# EAGLE schematic Carrier_Board (EAGLE 9.5.2)
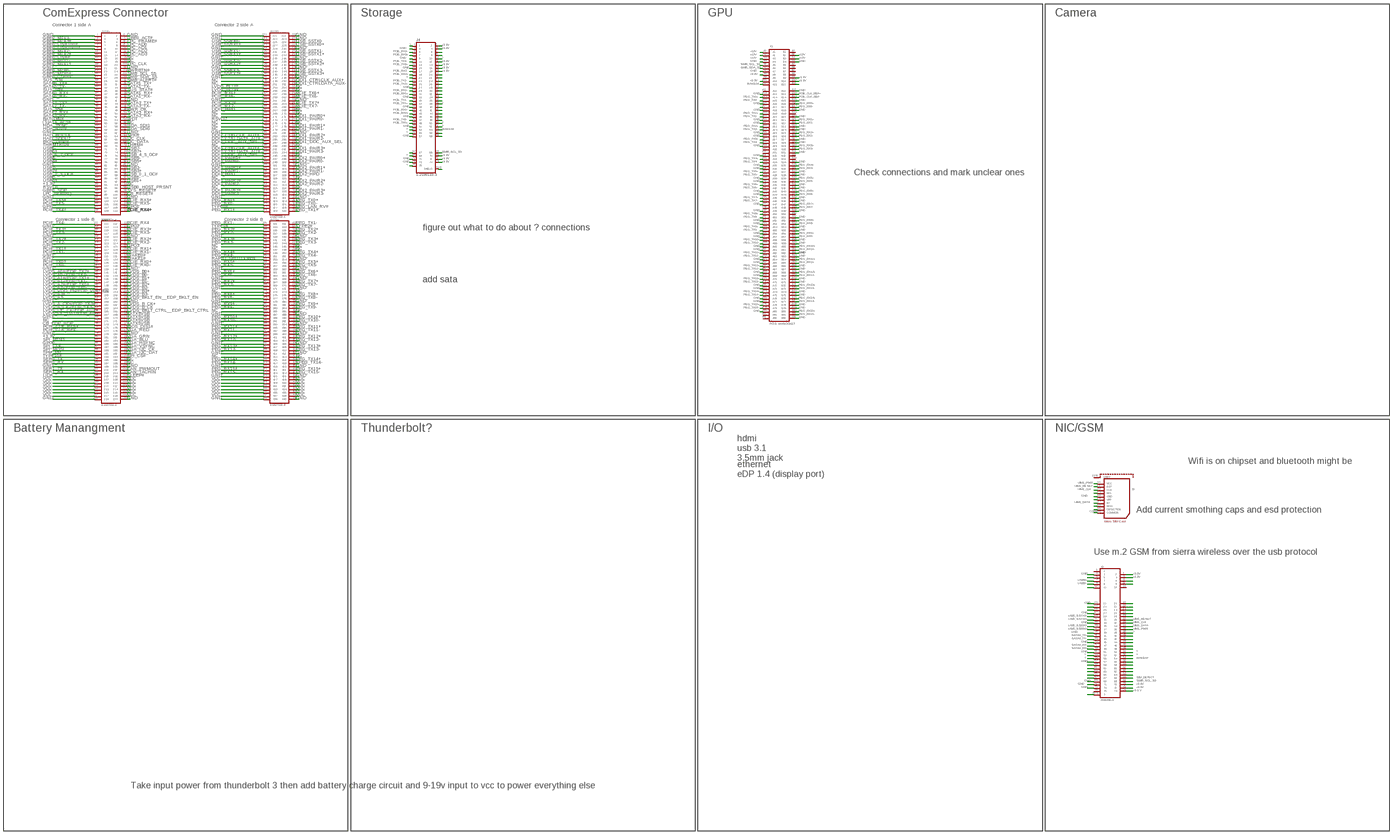
[diagram p0: schematic, sheet 1, overview]
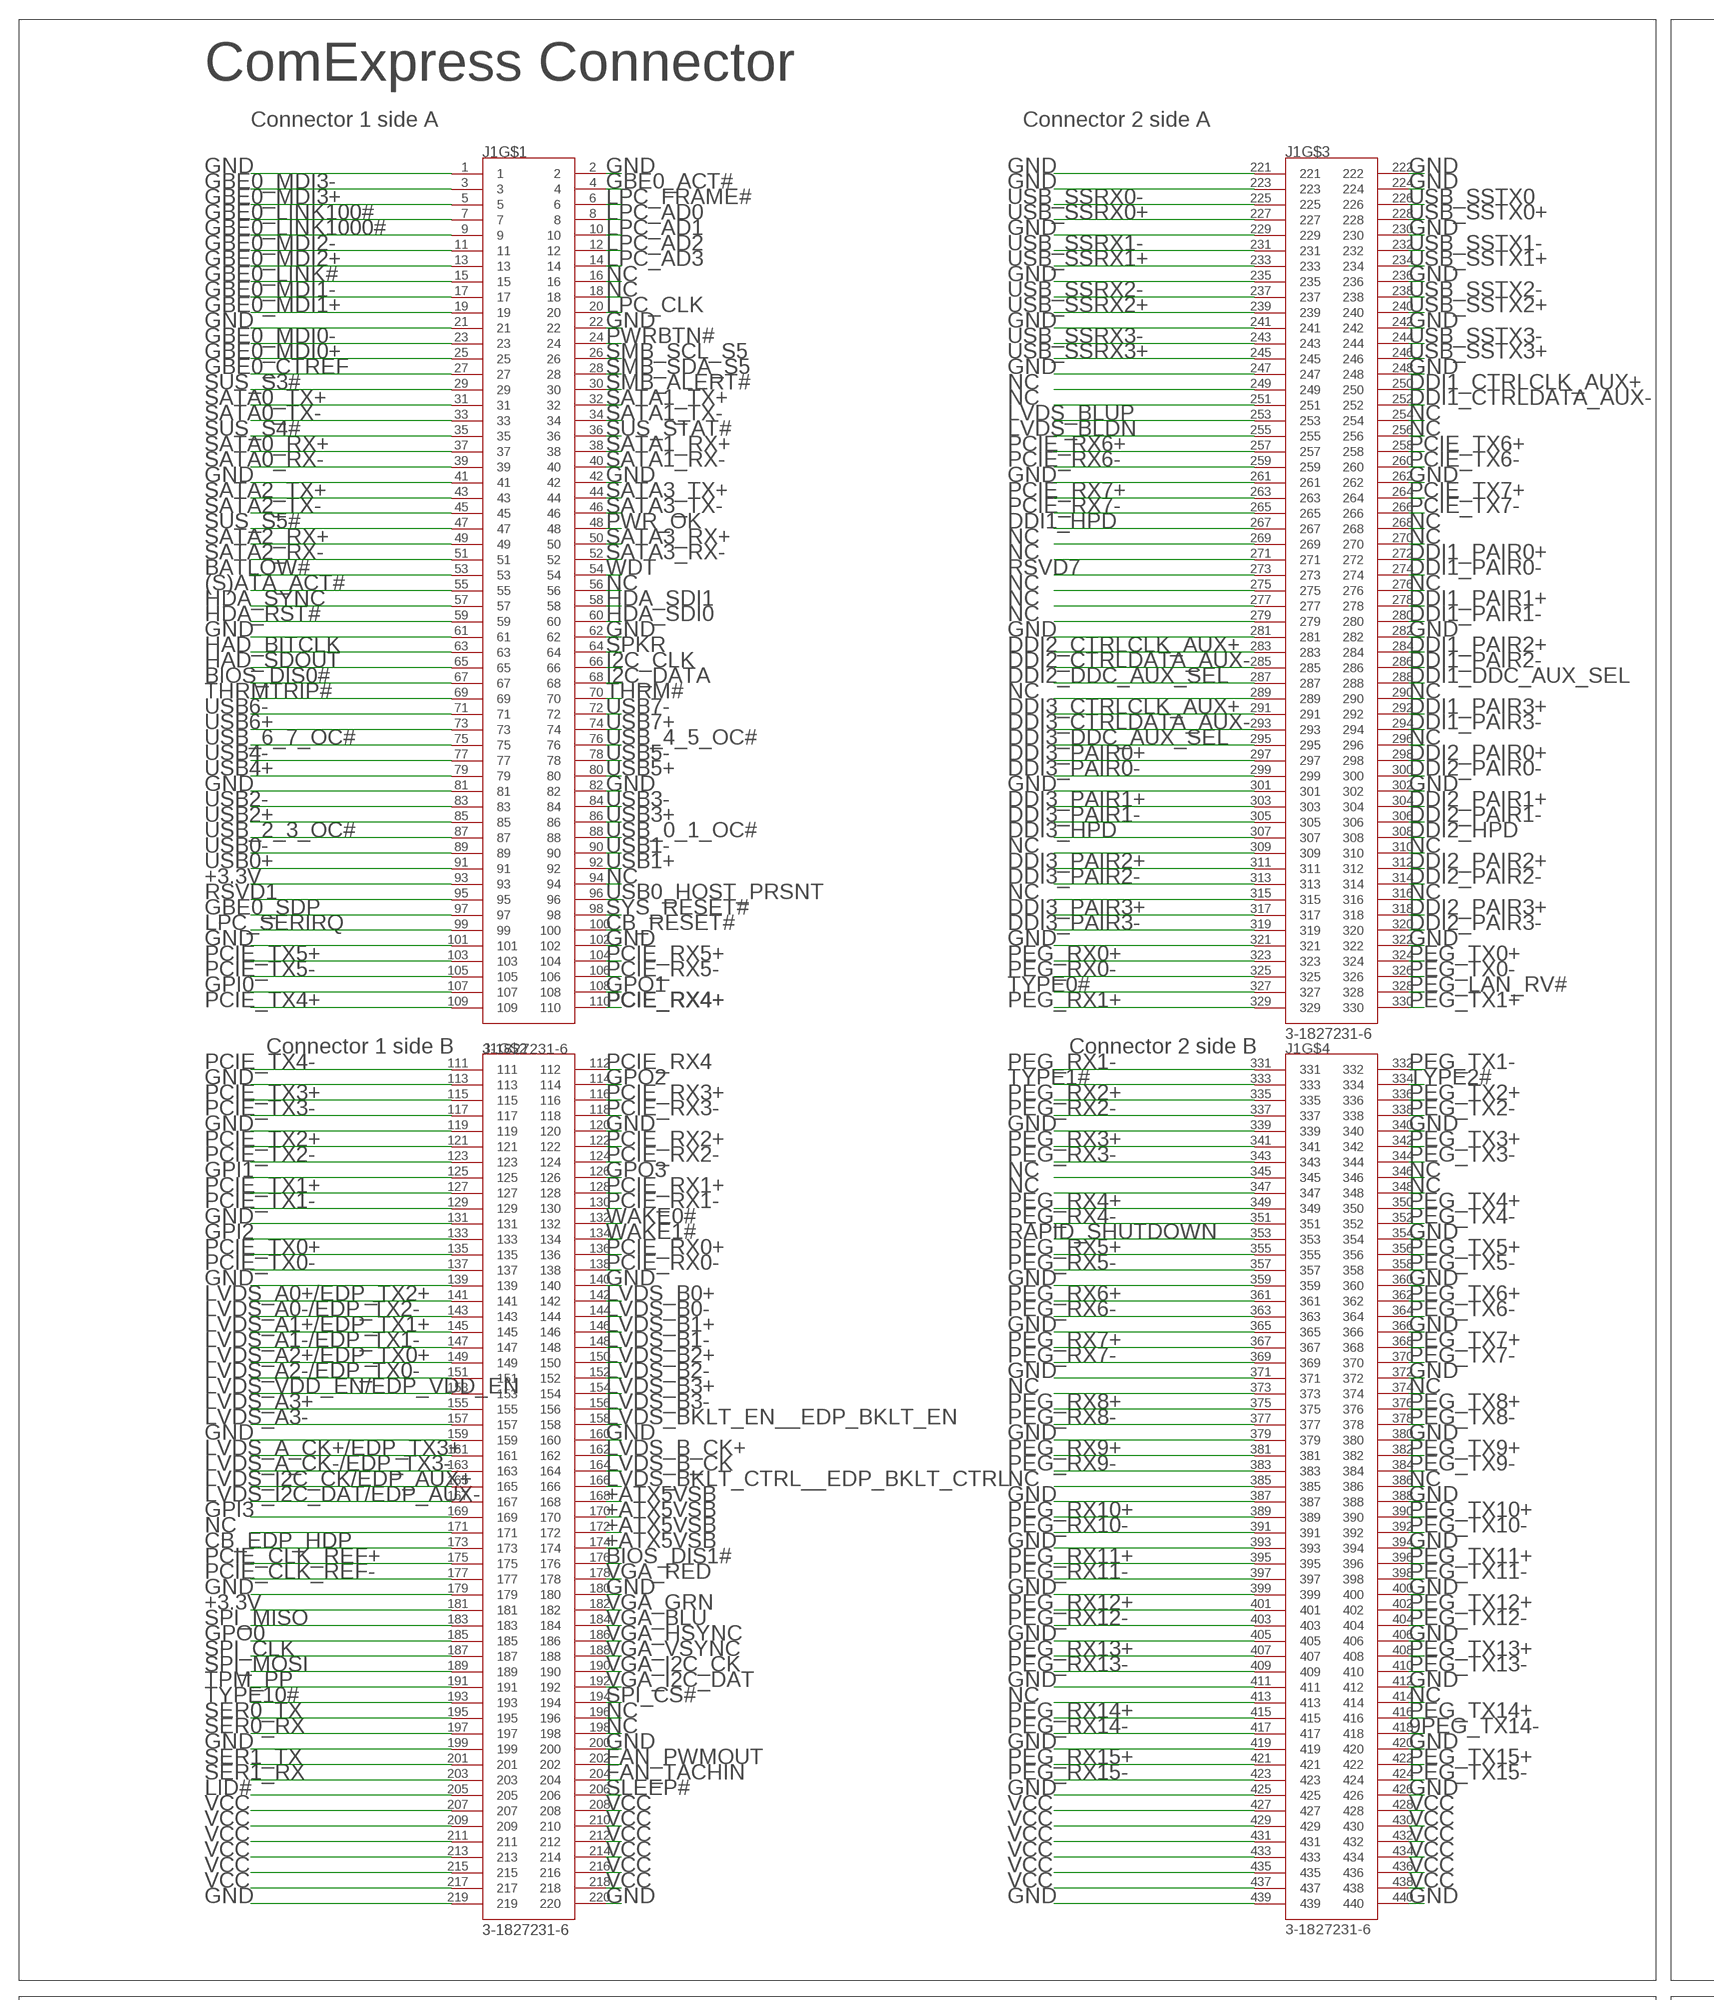
[diagram p1: schematic, sheet 1, part 1 of 8]
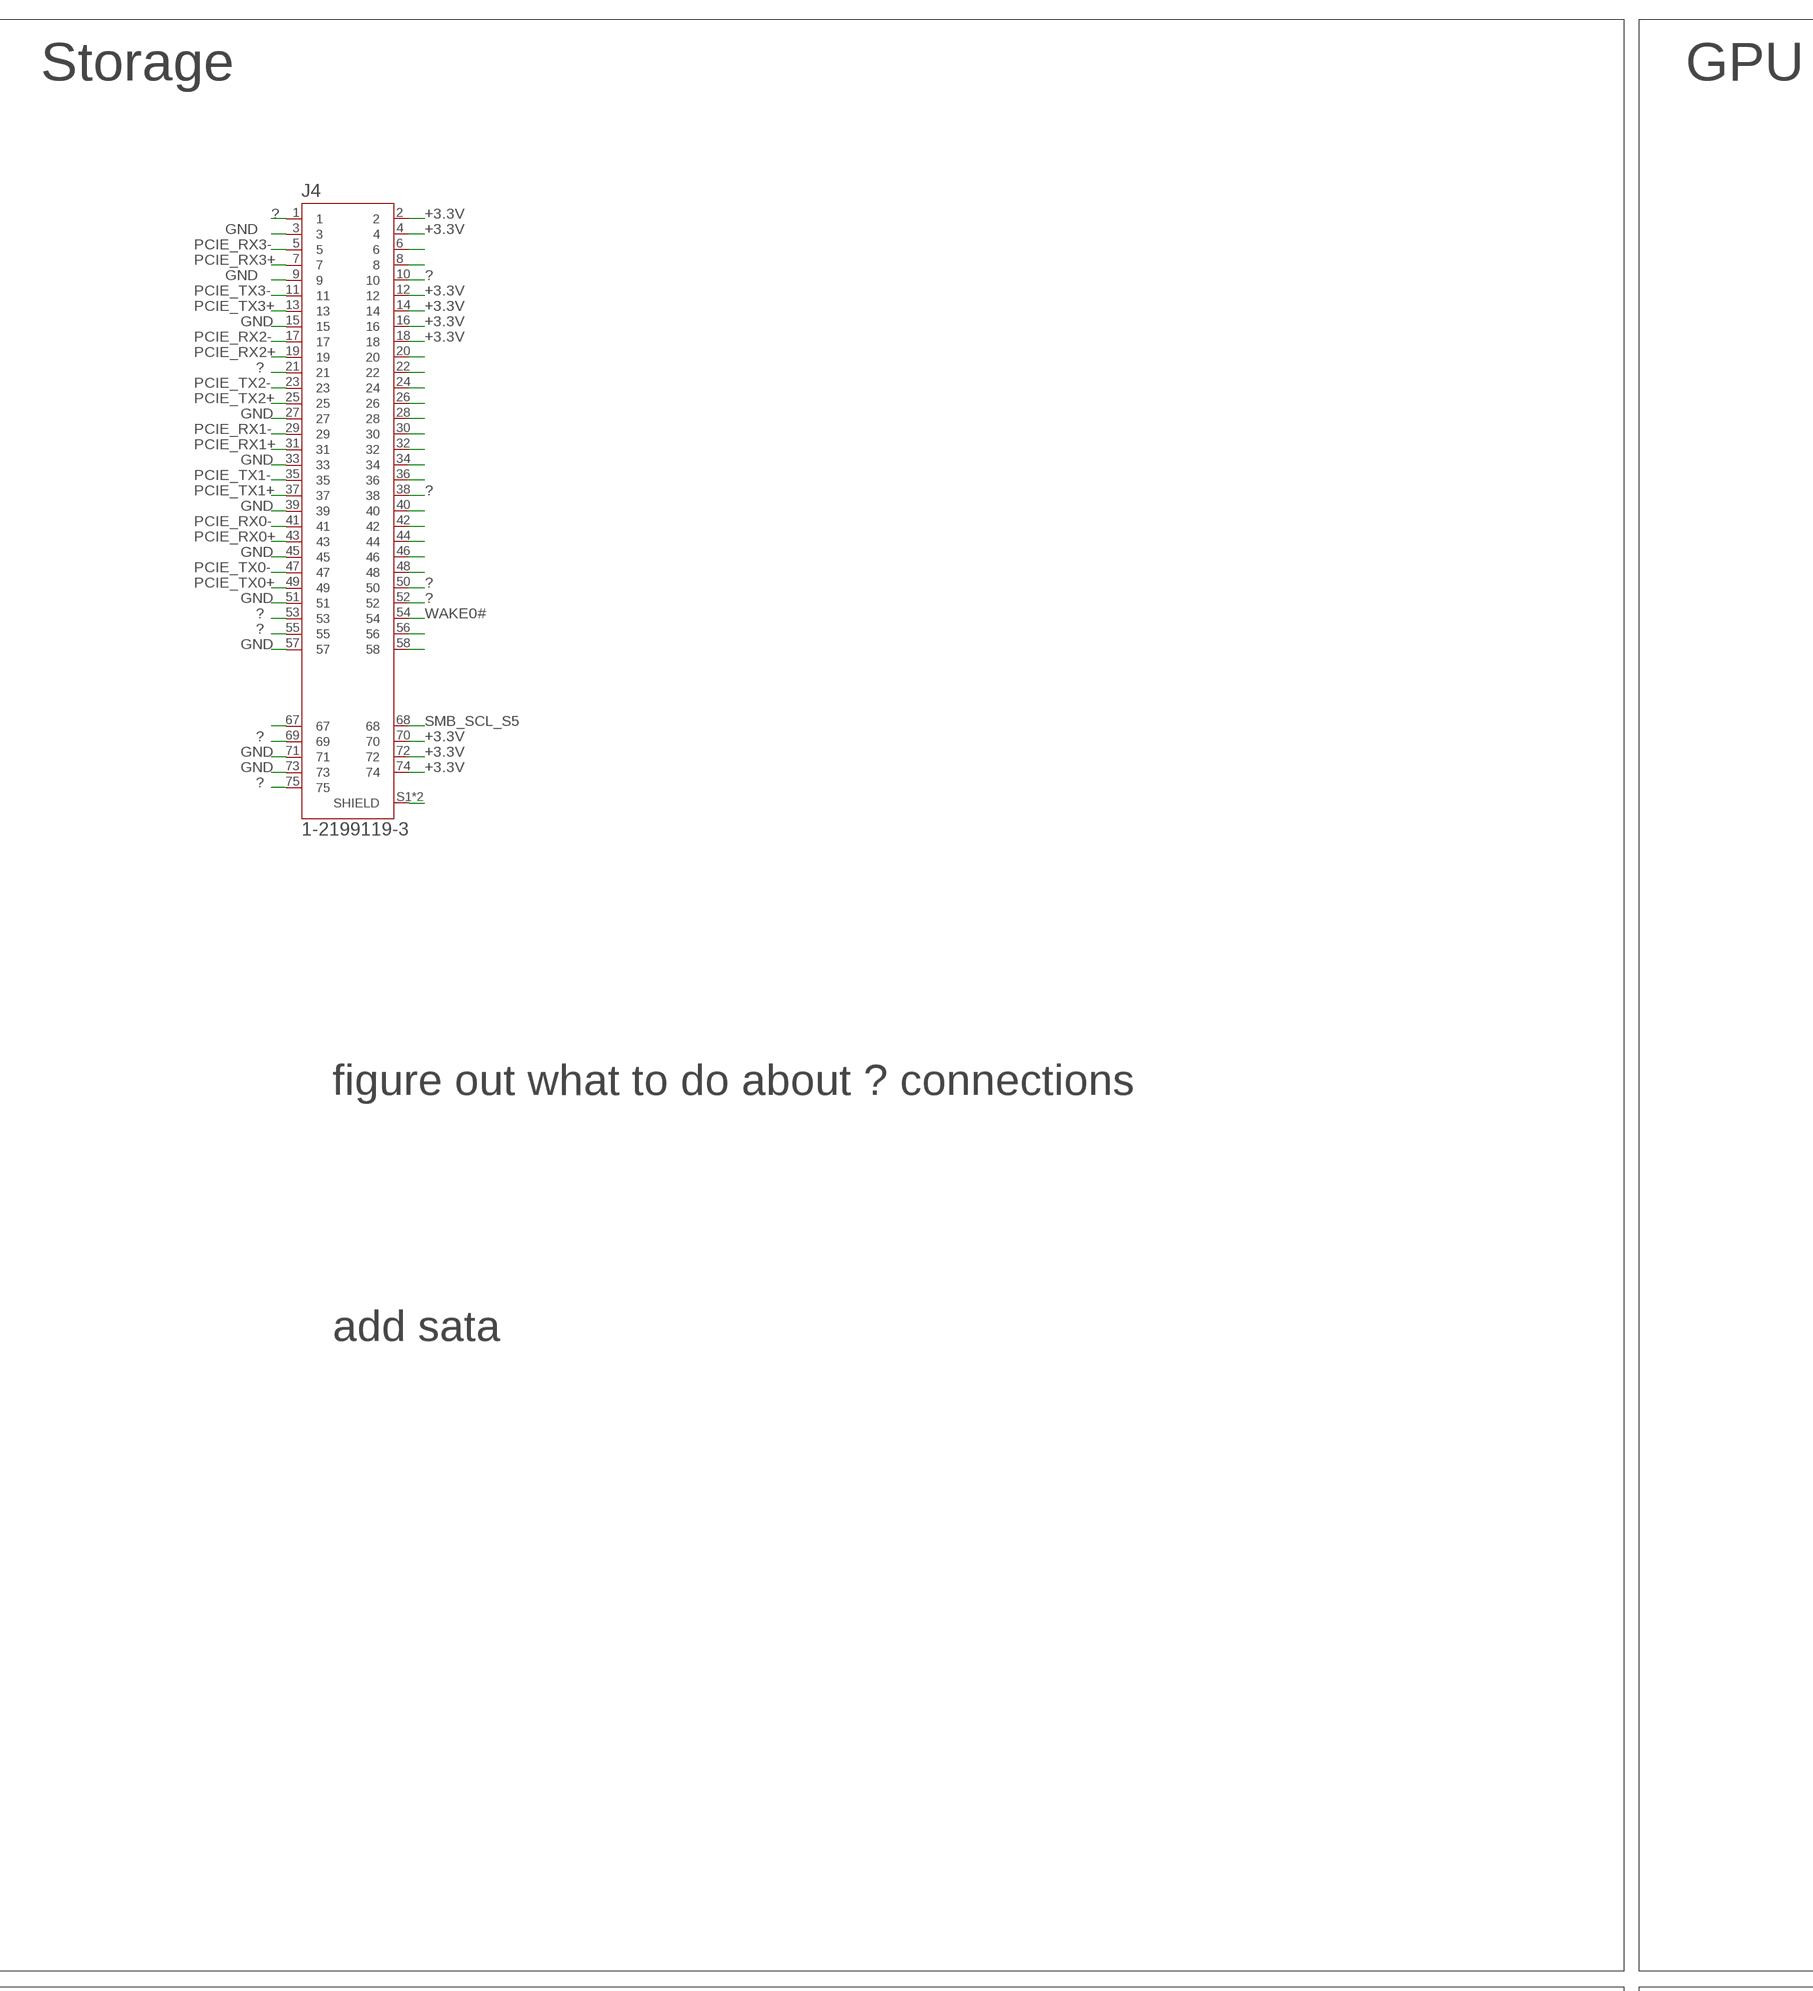
[diagram p2: schematic, sheet 1, part 2 of 8]
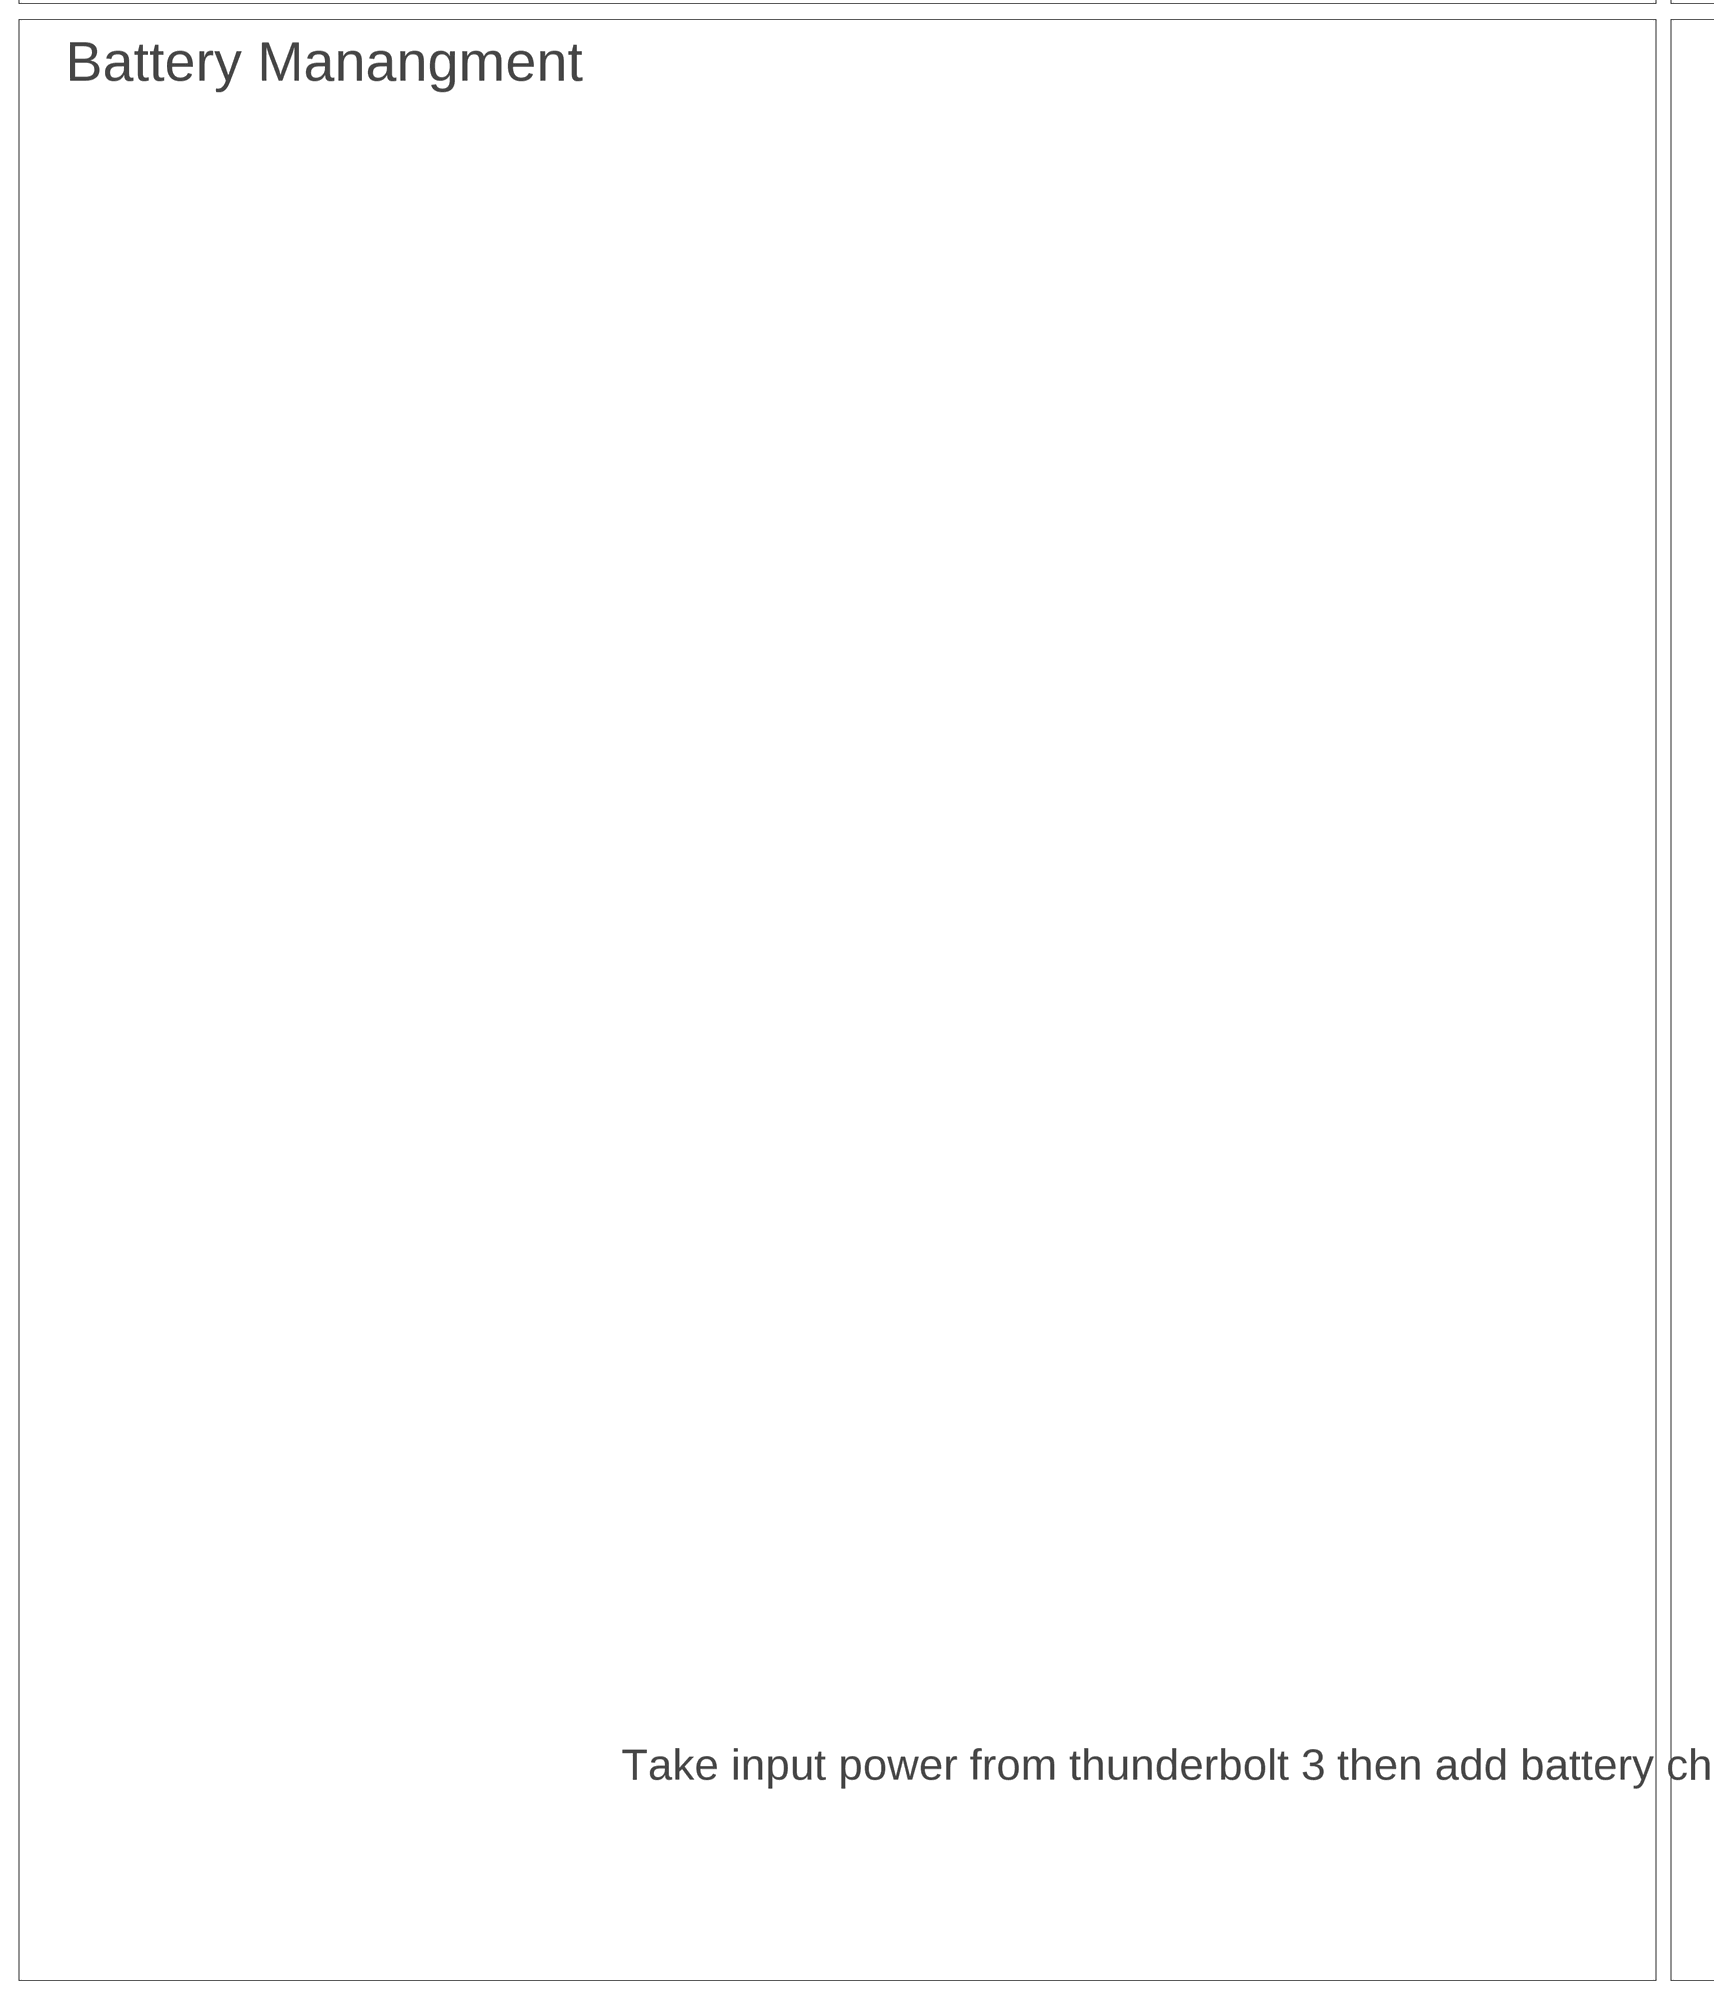
[diagram p3: schematic, sheet 1, part 3 of 8]
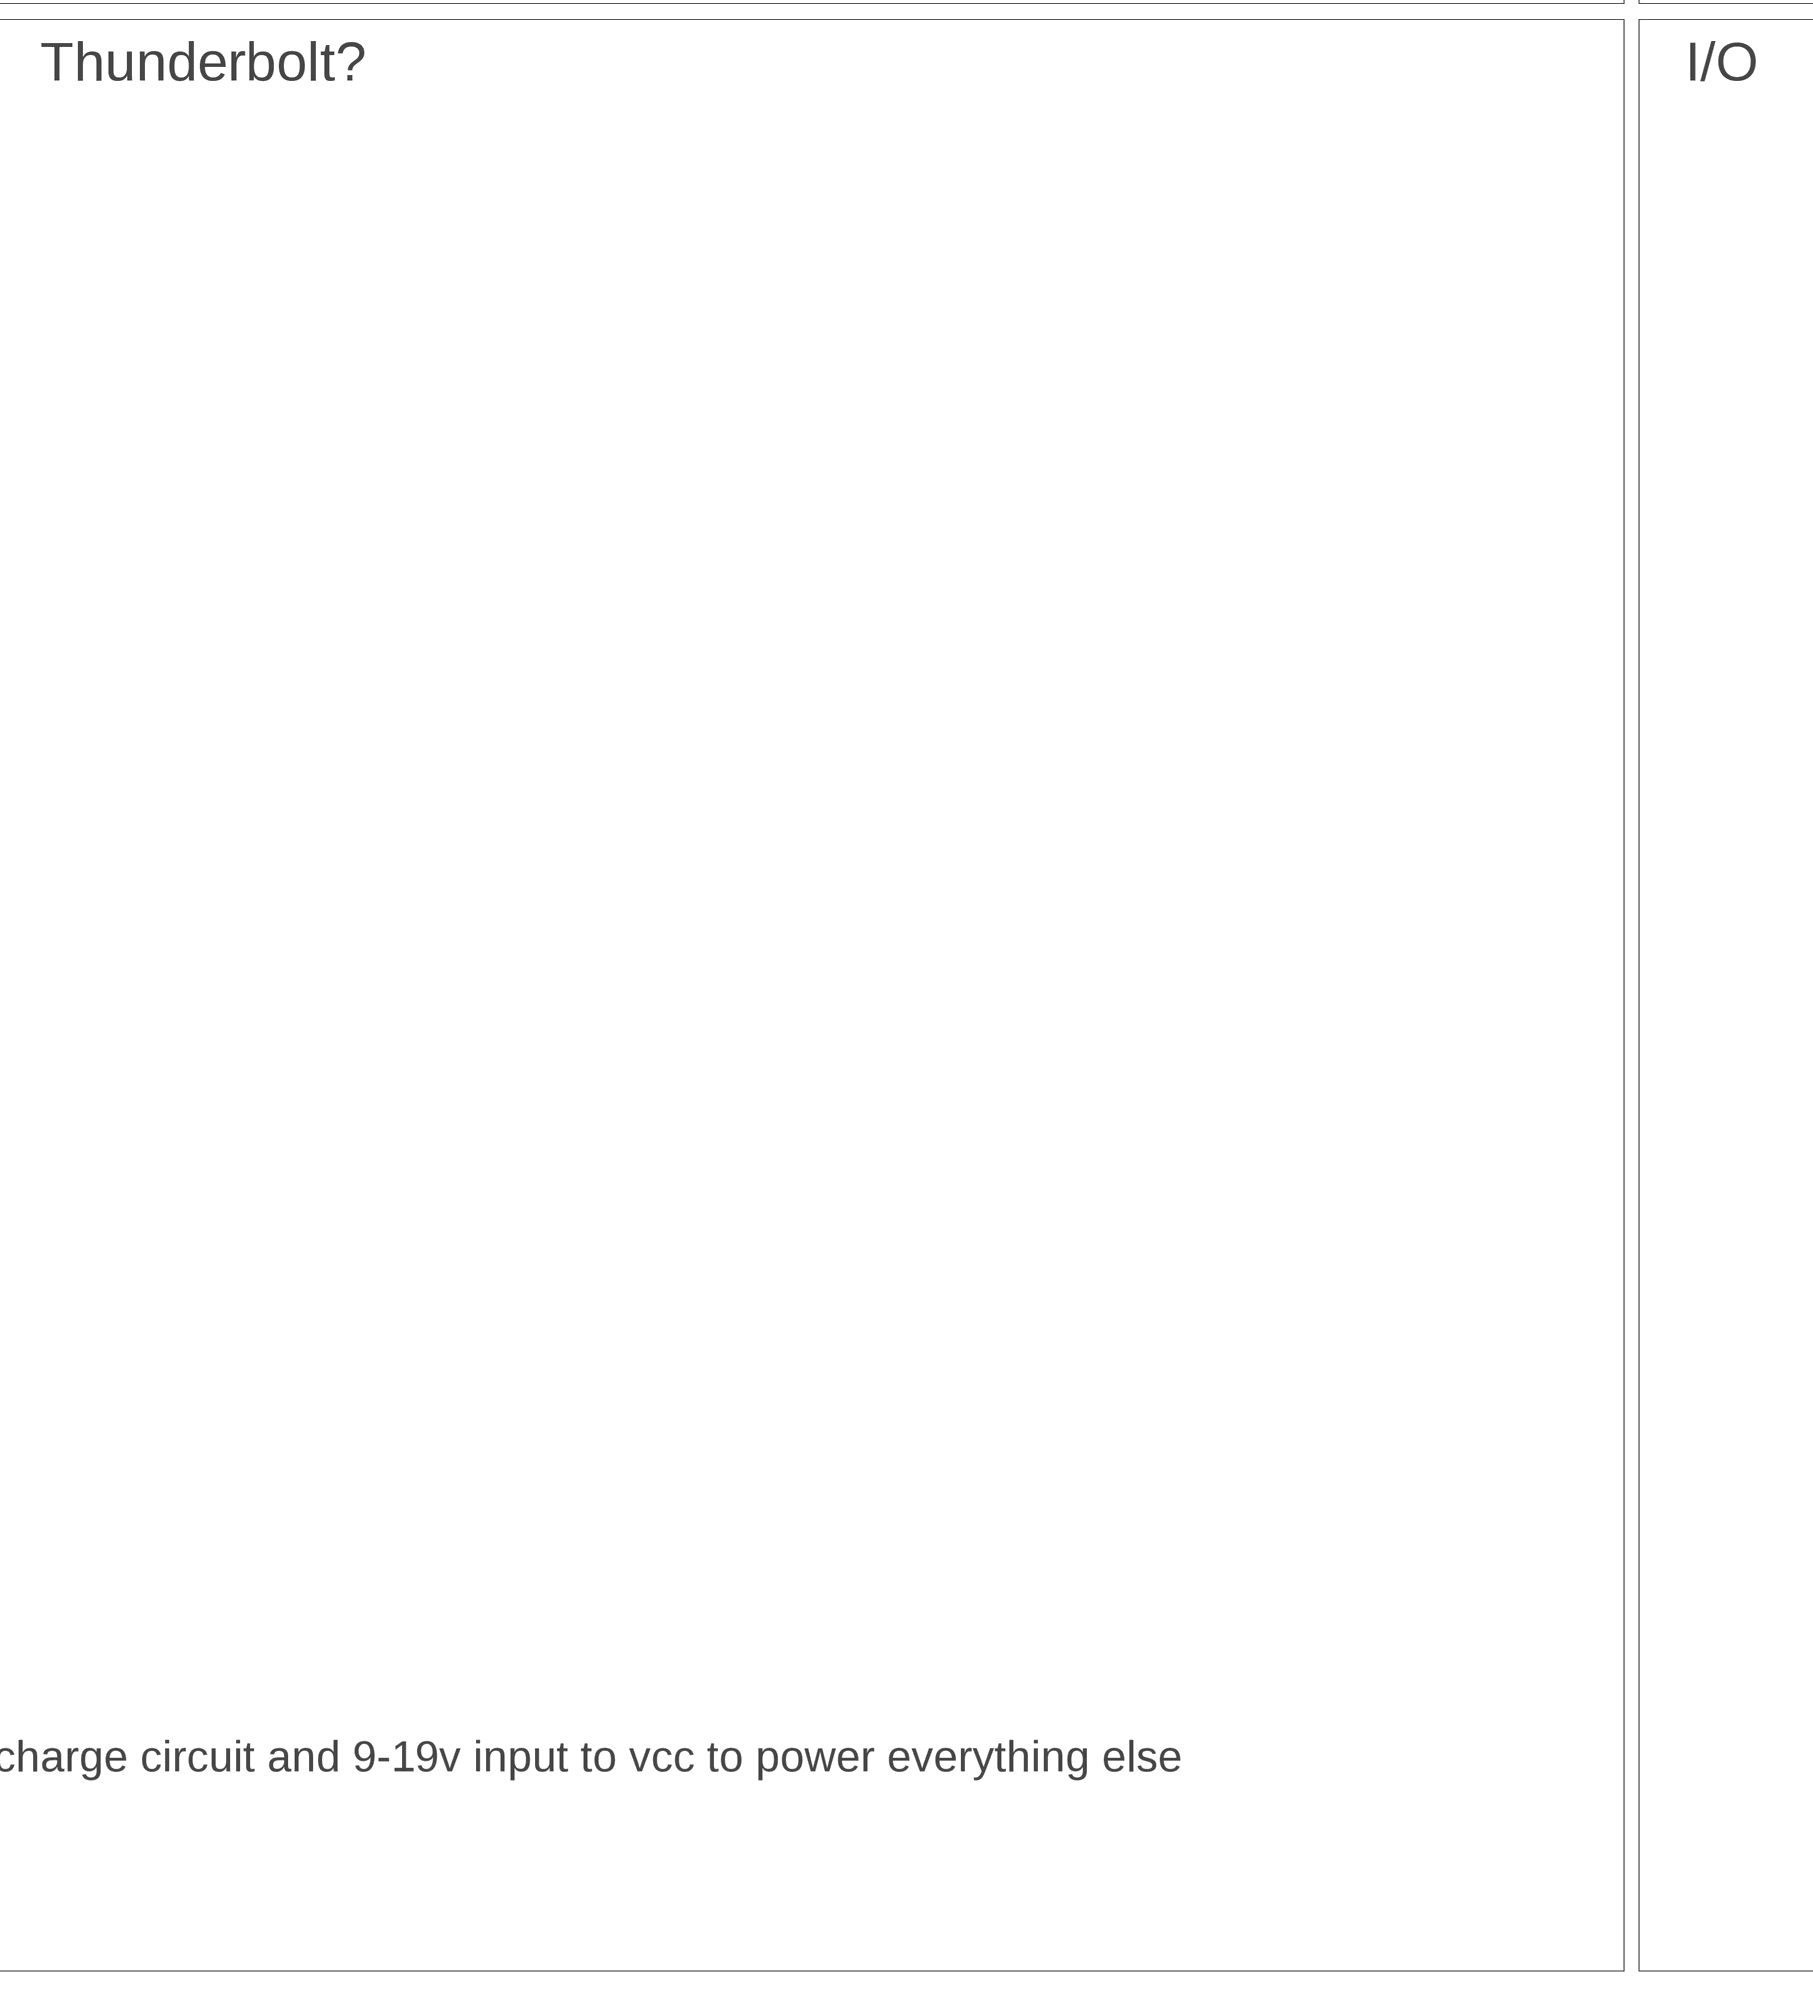
[diagram p4: schematic, sheet 1, part 4 of 8]
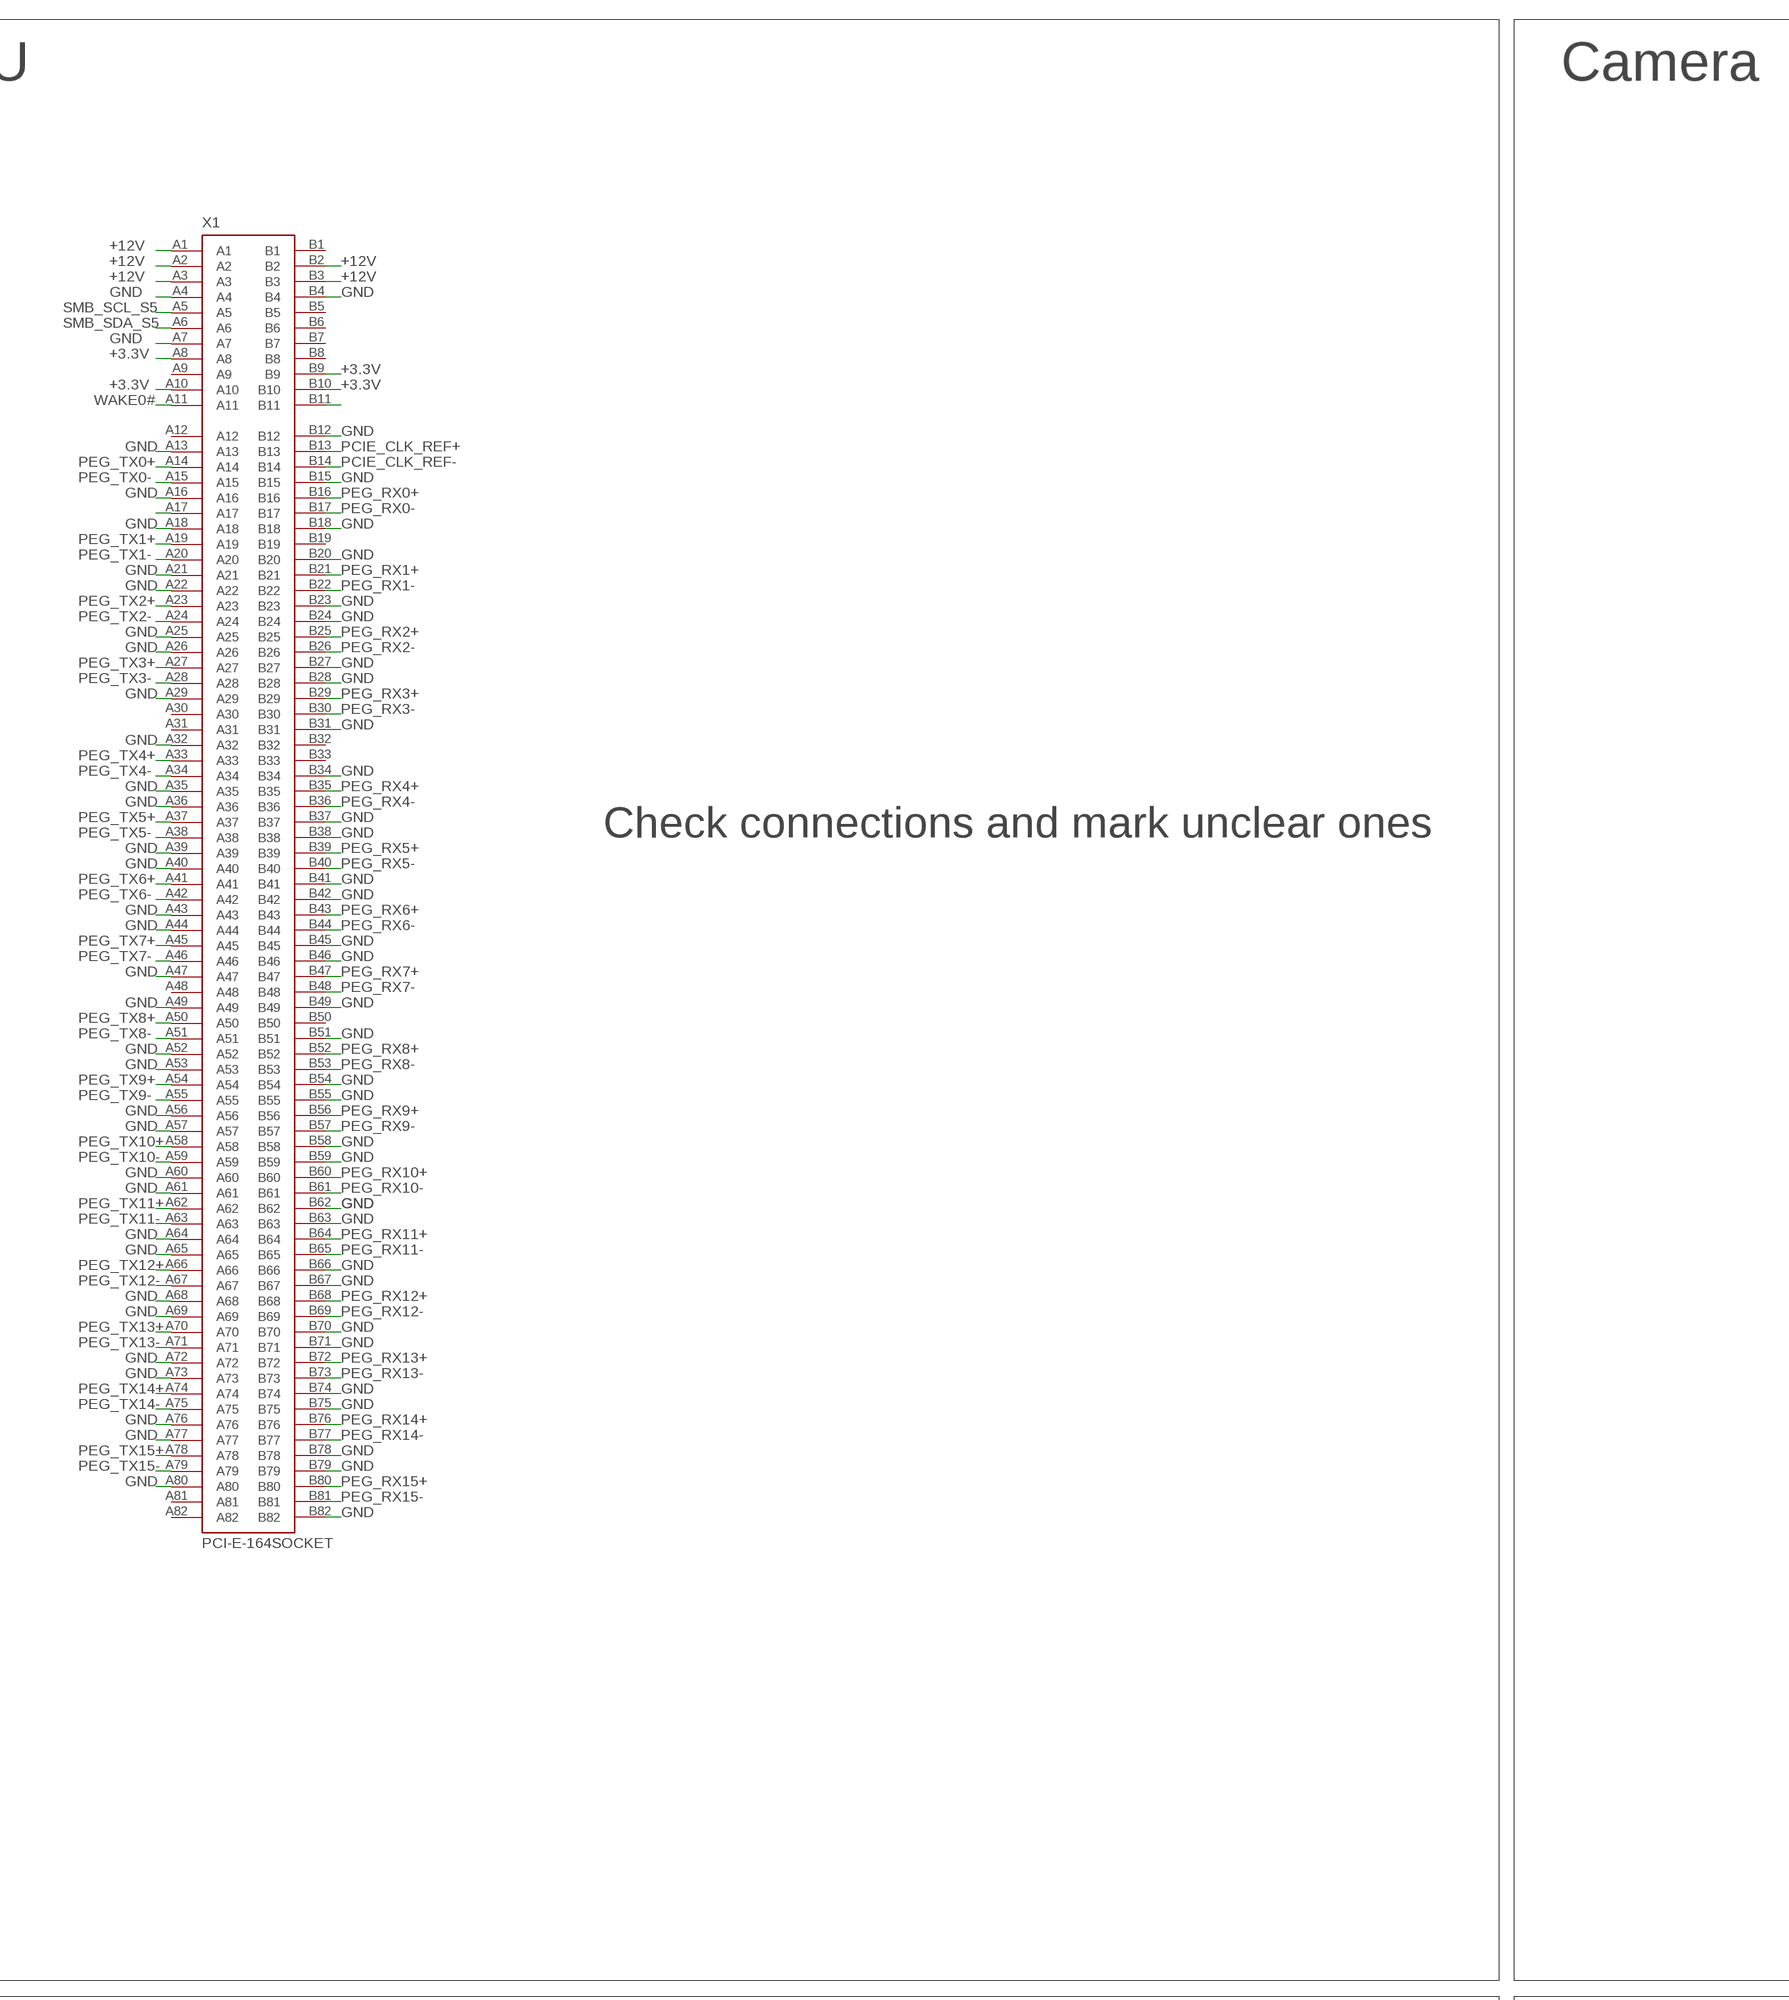
[diagram p5: schematic, sheet 1, part 5 of 8]
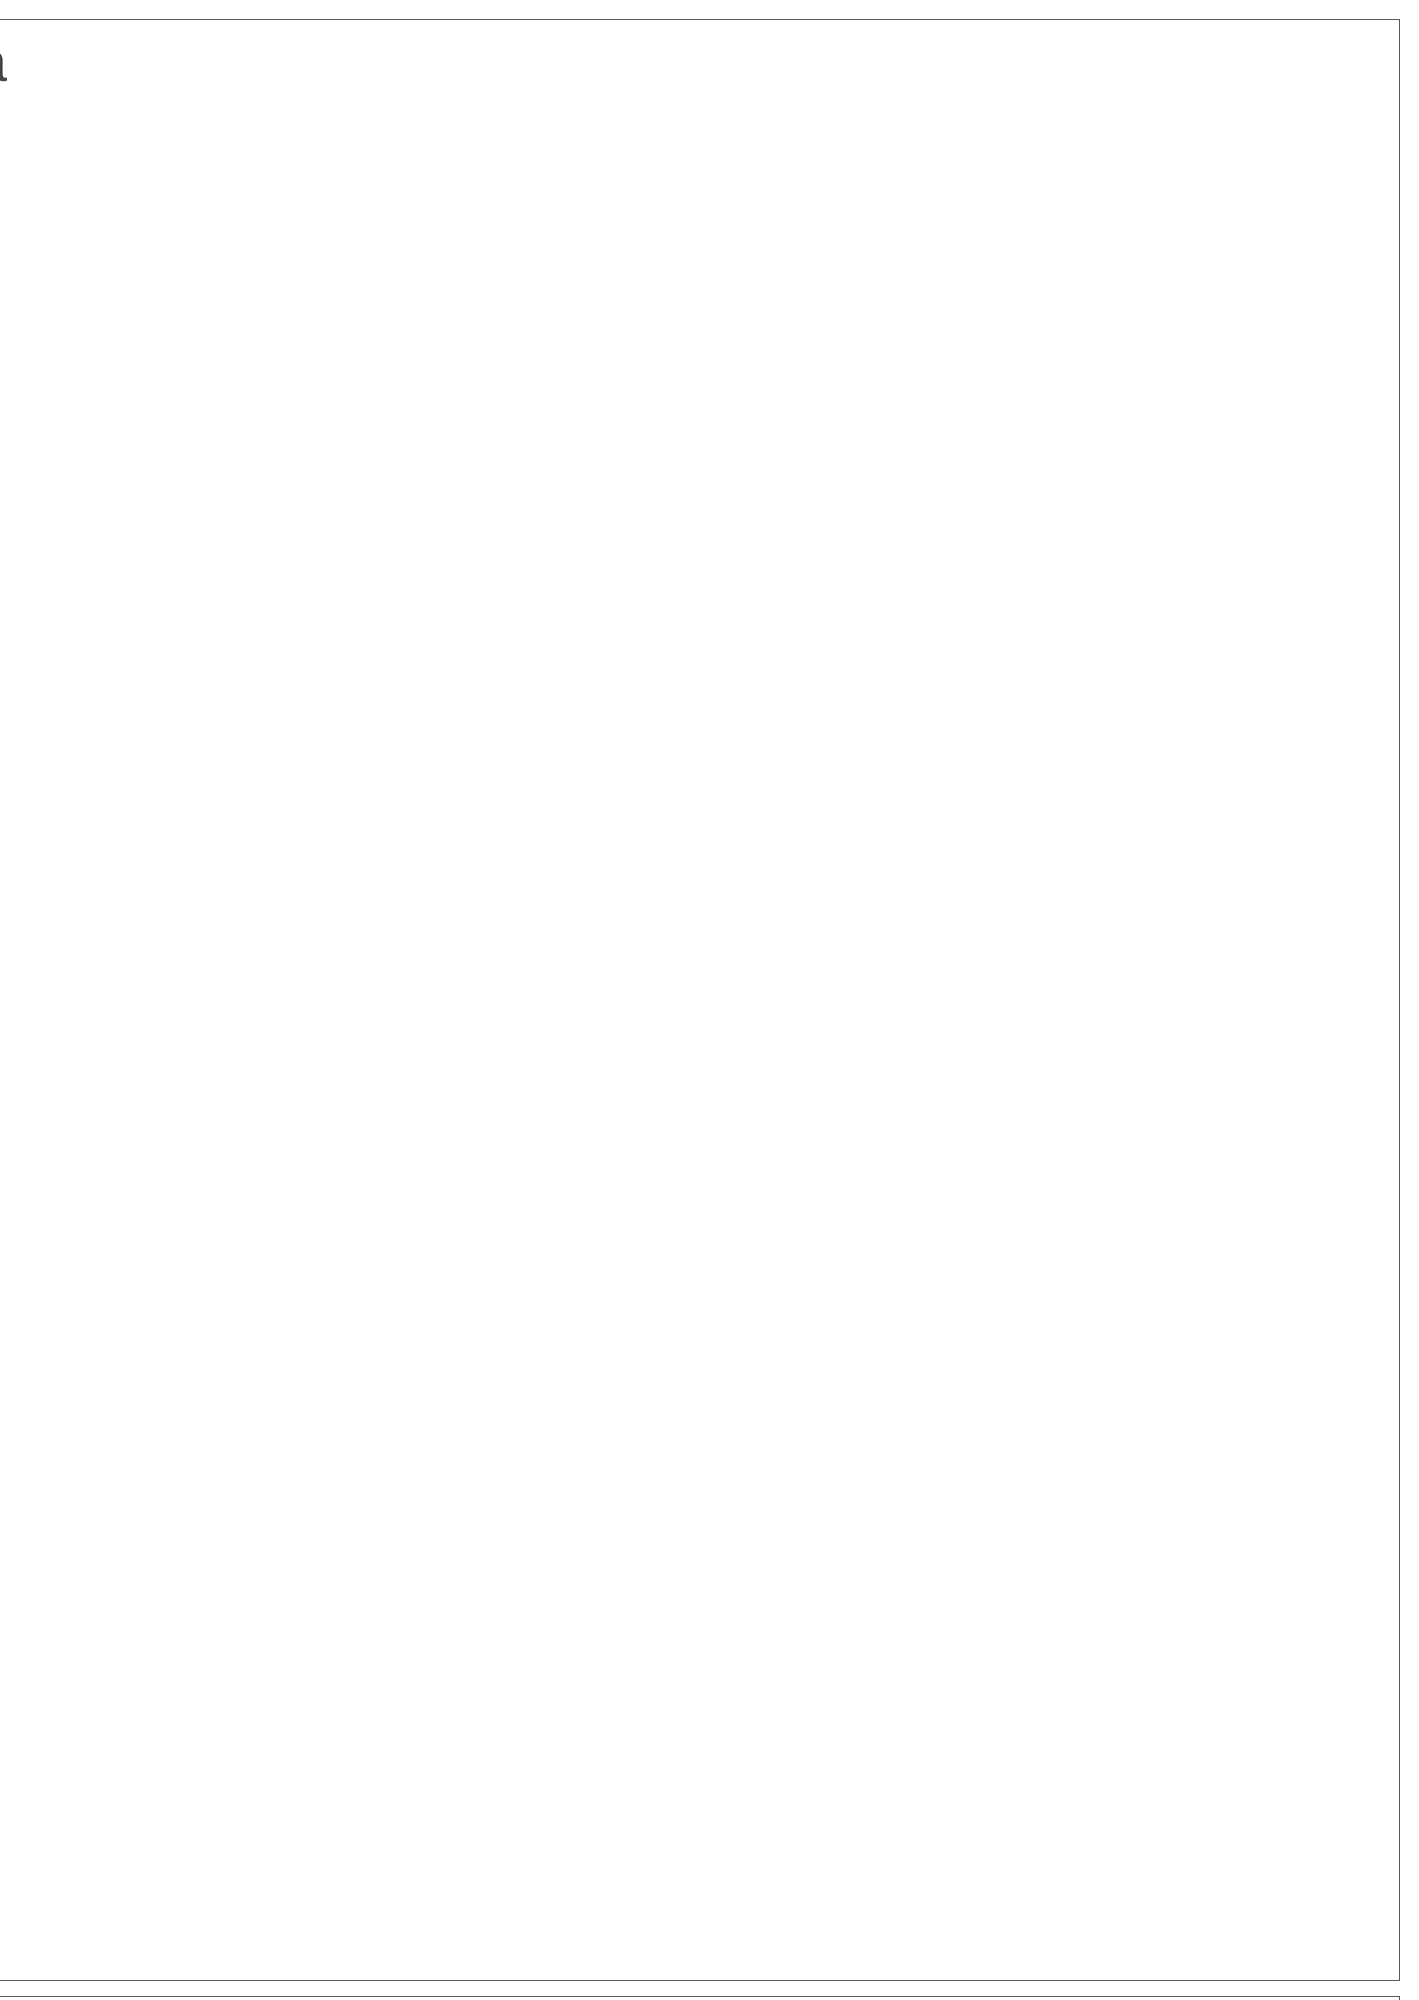
[diagram p6: schematic, sheet 1, part 6 of 8]
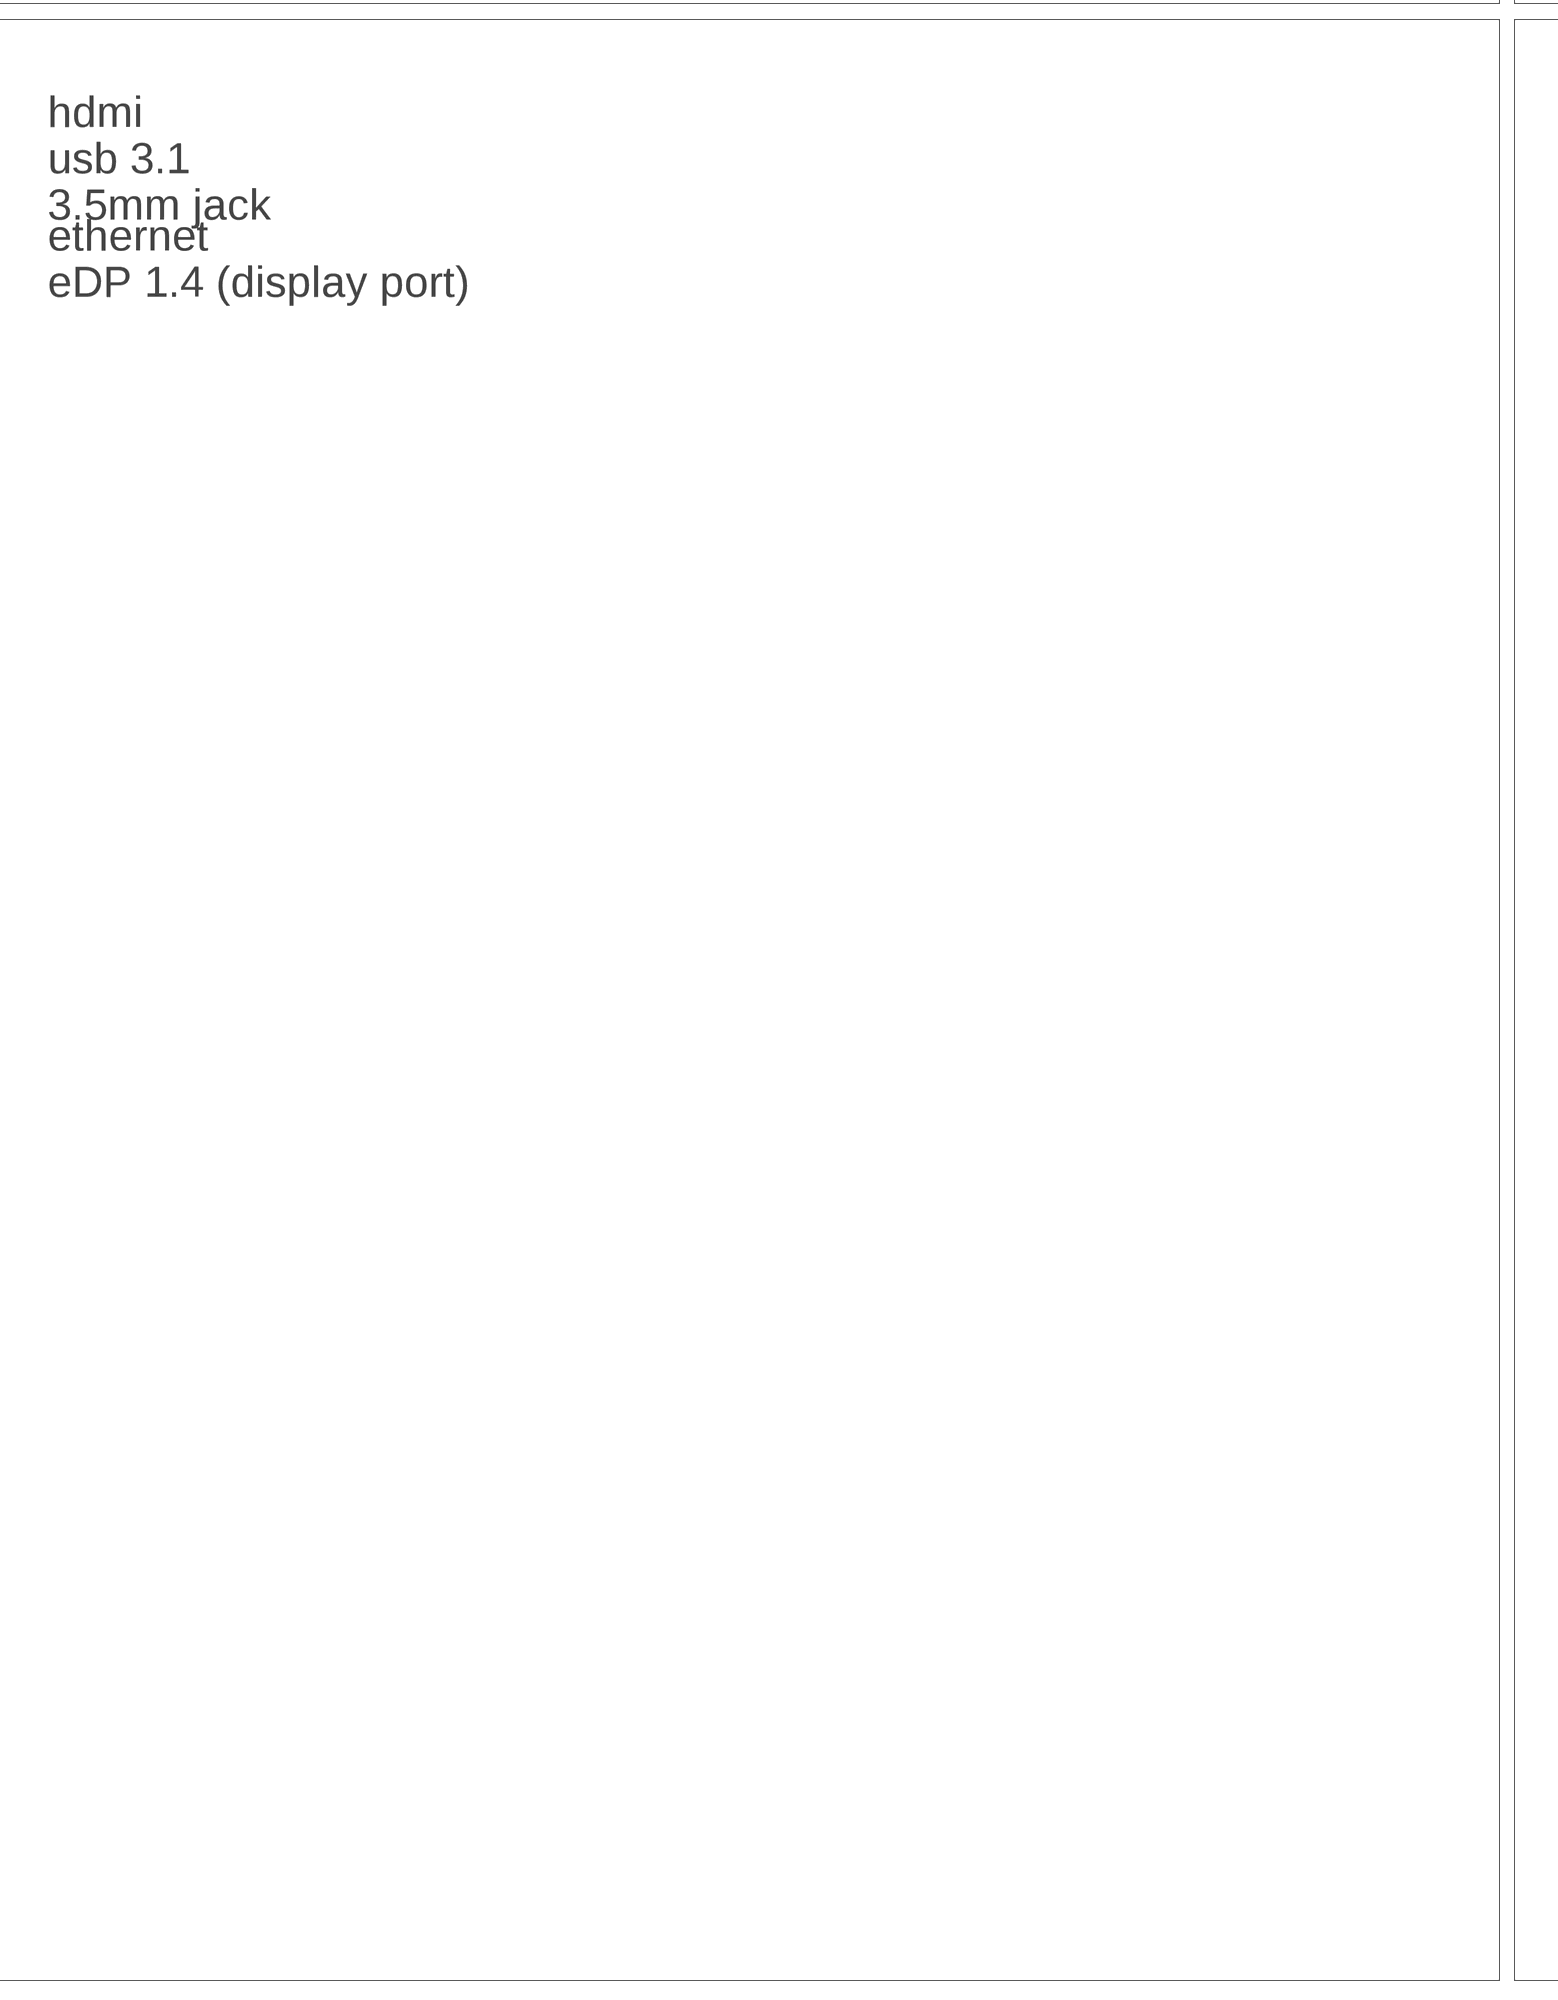
[diagram p7: schematic, sheet 1, part 7 of 8]
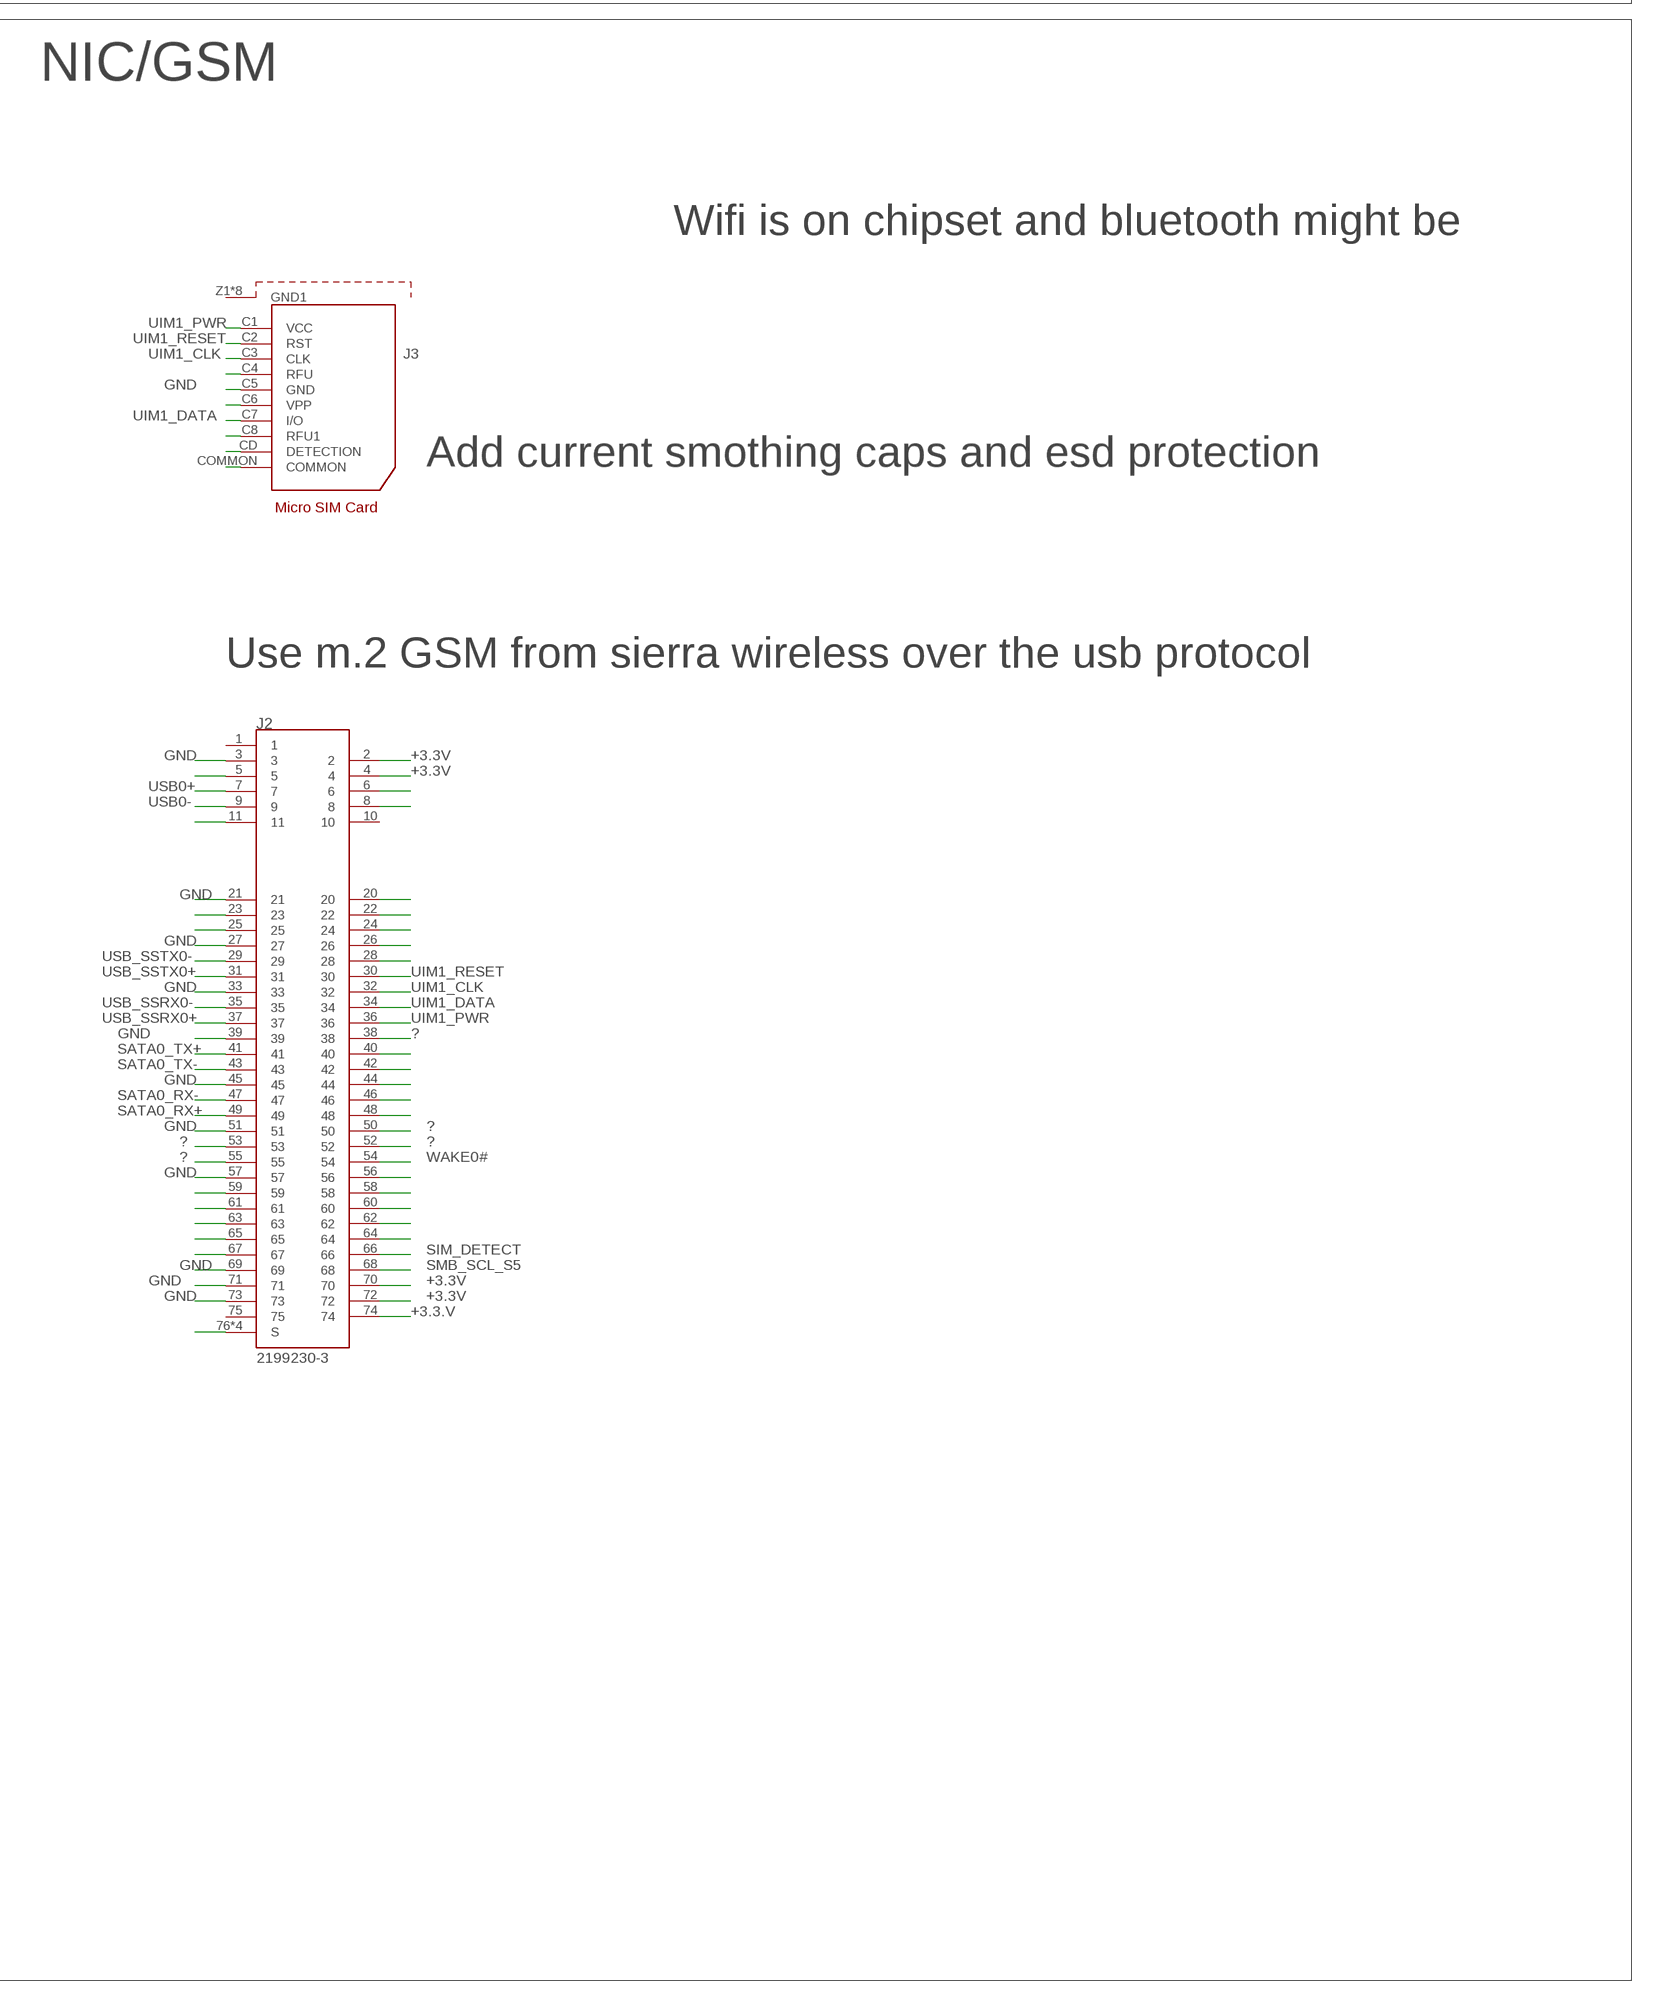
[diagram p8: schematic, sheet 1, part 8 of 8]

## Parts
J1  3-1827231-6  [TE_3-1827231-6]
J2  2199230-3  [TE_2199230-3]
J3  693021010811  [693021010811]
J4  1-2199119-3  [TE_1-2199119-3]
X1  PCI-E-164SOCKET  [PCI-E-164]

## Nets
9PEG_TX14-: J1.418
(S)ATA_ACT#: J1.55
+3.3.V: J2.74
+3.3V: J1.93 J1.181 J2.2 J2.4 J2.70 J2.72 J4.2 J4.4 J4.12 J4.14 J4.16 J4.18 J4.70 J4.72 J4.74 X1.A8 X1.A10 X1.B9 X1.B10
+12V: X1.A1 X1.A2 X1.A3 X1.B2 X1.B3
+ATX5VSB: J1.168 J1.170 J1.172 J1.174
?: J2.38 J2.50 J2.52 J2.53 J2.55 J4.1 J4.10 J4.21 J4.38 J4.50 J4.52 J4.53 J4.55 J4.56 J4.69 J4.75
BATLOW#: J1.53
BIOS_DIS0#: J1.67
BIOS_DIS1#: J1.176
CB_EDP_HDP: J1.173
CB_RESET#: J1.100
DDI1_CTRLCLK_AUX+: J1.250
DDI1_CTRLDATA_AUX-: J1.252
DDI1_DDC_AUX_SEL: J1.288
DDI1_HPD: J1.267
DDI1_PAIR0+: J1.272
DDI1_PAIR0-: J1.274
DDI1_PAIR1+: J1.278
DDI1_PAIR1-: J1.280
DDI1_PAIR2+: J1.284
DDI1_PAIR2-: J1.286
DDI1_PAIR3+: J1.292
DDI1_PAIR3-: J1.294
DDI2_CTRLCLK_AUX+: J1.283
DDI2_CTRLDATA_AUX-: J1.285
DDI2_DDC_AUX_SEL: J1.287
DDI2_HPD: J1.308
DDI2_PAIR0+: J1.298
DDI2_PAIR0-: J1.300
DDI2_PAIR1+: J1.304
DDI2_PAIR1-: J1.306
DDI2_PAIR2+: J1.312
DDI2_PAIR2-: J1.314
DDI2_PAIR3+: J1.318
DDI2_PAIR3-: J1.320
DDI3_CTRLCLK_AUX+: J1.291
DDI3_CTRLDATA_AUX-: J1.293
DDI3_DDC_AUX_SEL: J1.295
DDI3_HPD: J1.307
DDI3_PAIR0+: J1.297
DDI3_PAIR0-: J1.299
DDI3_PAIR1+: J1.303
DDI3_PAIR1-: J1.305
DDI3_PAIR2+: J1.311
DDI3_PAIR2-: J1.313
DDI3_PAIR3+: J1.317
DDI3_PAIR3-: J1.319
FAN_PWMOUT: J1.202
FAN_TACHIN: J1.204
GBE0_ACT#: J1.4
GBE0_CTREF: J1.27
GBE0_LINK100#: J1.7
GBE0_LINK1000#: J1.9
GBE0_LINK#: J1.15
GBE0_MDI0+: J1.25
GBE0_MDI0-: J1.23
GBE0_MDI1+: J1.19
GBE0_MDI1-: J1.17
GBE0_MDI2+: J1.13
GBE0_MDI2-: J1.11
GBE0_MDI3+: J1.5
GBE0_MDI3-: J1.3
GBE0_SDP: J1.97
GND: J1.1 J1.2 J1.21 J1.22 J1.41 J1.42 J1.61 J1.62 J1.81 J1.82 J1.101 J1.102 J1.113 J1.119 J1.120 J1.131 J1.139 J1.140 J1.159 J1.160 J1.179 J1.180 J1.199 J1.200 J1.219 J1.220 J1.221 J1.222 J1.223 J1.224 J1.229 J1.230 J1.235 J1.236 J1.241 J1.242 J1.247 J1.248 J1.261 J1.262 J1.281 J1.282 J1.301 J1.302 J1.321 J1.322 J1.339 J1.340 J1.354 J1.359 J1.360 J1.365 J1.366 J1.371 J1.372 J1.379 J1.380 J1.387 J1.388 J1.393 J1.394 J1.399 J1.400 J1.405 J1.406 J1.411 J1.412 J1.419 J1.420 J1.425 J1.426 J1.439 J1.440 J2.3 J2.21 J2.27 J2.33 J2.39 J2.45 J2.51 J2.57 J2.69 J2.71 J2.73 J3.C5(GND) J4.3 J4.9 J4.15 J4.27 J4.33 J4.39 J4.45 J4.51 J4.57 J4.71 J4.73 X1.A4 X1.A7 X1.A13 X1.A16 X1.A18 X1.A21 X1.A22 X1.A25 X1.A26 X1.A29 X1.A32 X1.A35 X1.A36 X1.A39 X1.A40 X1.A43 X1.A44 X1.A47 X1.A49 X1.A52 X1.A53 X1.A56 X1.A57 X1.A60 X1.A61 X1.A64 X1.A65 X1.A68 X1.A69 X1.A72 X1.A73 X1.A76 X1.A77 X1.A80 X1.B4 X1.B12 X1.B15 X1.B18 X1.B20 X1.B23 X1.B24 X1.B27 X1.B28 X1.B31 X1.B34 X1.B37 X1.B38 X1.B41 X1.B42 X1.B45 X1.B46 X1.B49 X1.B51 X1.B54 X1.B55 X1.B58 X1.B59 X1.B62 X1.B63 X1.B66 X1.B67 X1.B70 X1.B71 X1.B74 X1.B75 X1.B78 X1.B79 X1.B82
GPI0: J1.107
GPI1: J1.125
GPI2: J1.133
GPI3: J1.169
GPO0: J1.185
GPO1: J1.108
GPO2: J1.114
GPO3: J1.126
HAD_BITCLK: J1.63
HAD_SDOUT: J1.65
HDA_RST#: J1.59
HDA_SDI0: J1.60
HDA_SDI1: J1.58
HDA_SYNC: J1.57
I2C_CLK: J1.66
I2C_DATA: J1.68
LID#: J1.205
LPC_AD0: J1.8
LPC_AD1: J1.10
LPC_AD2: J1.12
LPC_AD3: J1.14
LPC_CLK: J1.20
LPC_FRAME#: J1.6
LPC_SERIRQ: J1.99
LVDS_A0+/EDP_TX2+: J1.141
LVDS_A0-/EDP_TX2-: J1.143
LVDS_A1+/EDP_TX1+: J1.145
LVDS_A1-/EDP_TX1-: J1.147
LVDS_A2+/EDP_TX0+: J1.149
LVDS_A2-/EDP_TX0-: J1.151
LVDS_A3+: J1.155
LVDS_A3-: J1.157
LVDS_A_CK+/EDP_TX3+: J1.161
LVDS_A_CK-/EDP_TX3-: J1.163
LVDS_B0+: J1.142
LVDS_B0-: J1.144
LVDS_B1+: J1.146
LVDS_B1-: J1.148
LVDS_B2+: J1.150
LVDS_B2-: J1.152
LVDS_B3+: J1.154
LVDS_B3-: J1.156
LVDS_B_CK: J1.164
LVDS_B_CK+: J1.162
LVDS_BKLT_CTRL__EDP_BKLT_CTRL: J1.166
LVDS_BKLT_EN__EDP_BKLT_EN: J1.158
LVDS_BLDN: J1.255
LVDS_BLUP: J1.253
LVDS_I2C_CK/EDP_AUX+: J1.165
LVDS_I2C_DAT/EDP_AUX-: J1.167
LVDS_VDD_EN/EDP_VDD_EN: J1.153
N$6: J2.11
N$7: J4.6
N$8: J4.8
N$9: J3.C4(RFU)
N$11: J3.C6(VPP)
N$12: J2.6
N$13: J2.8
N$15: J2.23
N$16: J2.25
N$17: J3.C8(RFU1)
N$18: J3.CD(DETECTION)
N$19: J3.COMMON
N$20: J2.20
N$21: J2.22
N$22: X1.B11
N$23: J4.20
N$24: J4.22
N$25: J4.24
N$26: J2.24
N$27: J2.26
N$28: X1.A17
N$29: J2.28
N$31: J4.26
N$32: J4.28
N$33: J4.30
N$34: J4.32
N$39: J4.34
N$40: J4.36
N$42: J4.40
N$47: J4.42
N$48: J4.44
N$49: J4.46
N$50: J4.48
N$52: J2.40
N$53: J2.42
N$60: J4.58
N$61: J2.44
N$62: J2.46
N$63: J2.48
N$64: J4.S1(SHIELD) J4.S2(SHIELD)
N$68: J4.67
N$70: J2.59
N$71: J2.61
N$72: J2.63
N$73: J2.65
N$74: J2.67
N$75: J2.56
N$76: J2.58
N$77: J2.60
N$78: J2.62
N$79: J2.64
N$85: J2.76(S) J2.77(S) J2.78(S) J2.79(S)
NC: J1.16 J1.18 J1.56 J1.94 J1.171 J1.196 J1.198 J1.249 J1.251 J1.254 J1.256 J1.268 J1.269 J1.270 J1.271 J1.275 J1.276 J1.277 J1.279 J1.289 J1.290 J1.296 J1.309 J1.310 J1.315 J1.316 J1.345 J1.346 J1.347 J1.348 J1.373 J1.374 J1.385 J1.386 J1.413 J1.414
PCIE_CLK_REF+: J1.175 X1.B13
PCIE_CLK_REF-: J1.177 X1.B14
PCIE_RX0+: J1.136 J4.43
PCIE_RX0-: J1.138 J4.41
PCIE_RX1+: J1.128 J4.31
PCIE_RX1-: J1.130 J4.29
PCIE_RX2+: J1.122 J4.19
PCIE_RX2-: J1.124 J4.17
PCIE_RX3+: J1.116 J4.7
PCIE_RX3-: J1.118 J4.5
PCIE_RX4: J1.112
PCIE_RX4+: J1.110
PCIE_RX5+: J1.104
PCIE_RX5-: J1.106
PCIE_RX6+: J1.257
PCIE_RX6-: J1.259
PCIE_RX7+: J1.263
PCIE_RX7-: J1.265
PCIE_TX0+: J1.135 J4.49
PCIE_TX0-: J1.137 J4.47
PCIE_TX1+: J1.127 J4.37
PCIE_TX1-: J1.129 J4.35
PCIE_TX2+: J1.121 J4.25
PCIE_TX2-: J1.123 J4.23
PCIE_TX3+: J1.115 J4.13
PCIE_TX3-: J1.117 J4.11
PCIE_TX4+: J1.109
PCIE_TX4-: J1.111
PCIE_TX5+: J1.103
PCIE_TX5-: J1.105
PCIE_TX6+: J1.258
PCIE_TX6-: J1.260
PCIE_TX7+: J1.264
PCIE_TX7-: J1.266
PEG_LAN_RV#: J1.328
PEG_RX0+: J1.323 X1.B16
PEG_RX0-: J1.325 X1.B17
PEG_RX1+: J1.329 X1.B21
PEG_RX1-: J1.331 X1.B22
PEG_RX2+: J1.335 X1.B25
PEG_RX2-: J1.337 X1.B26
PEG_RX3+: J1.341 X1.B29
PEG_RX3-: J1.343 X1.B30
PEG_RX4+: J1.349 X1.B35
PEG_RX4-: J1.351 X1.B36
PEG_RX5+: J1.355 X1.B39
PEG_RX5-: J1.357 X1.B40
PEG_RX6+: J1.361 X1.B43
PEG_RX6-: J1.363 X1.B44
PEG_RX7+: J1.367 X1.B47
PEG_RX7-: J1.369 X1.B48
PEG_RX8+: J1.375 X1.B52
PEG_RX8-: J1.377 X1.B53
PEG_RX9+: J1.381 X1.B56
PEG_RX9-: J1.383 X1.B57
PEG_RX10+: J1.389 X1.B60
PEG_RX10-: J1.391 X1.B61
PEG_RX11+: J1.395 X1.B64
PEG_RX11-: J1.397 X1.B65
PEG_RX12+: J1.401 X1.B68
PEG_RX12-: J1.403 X1.B69
PEG_RX13+: J1.407 X1.B72
PEG_RX13-: J1.409 X1.B73
PEG_RX14+: J1.415 X1.B76
PEG_RX14-: J1.417 X1.B77
PEG_RX15+: J1.421 X1.B80
PEG_RX15-: J1.423 X1.B81
PEG_TX0+: J1.324 X1.A14
PEG_TX0-: J1.326 X1.A15
PEG_TX1+: J1.330 X1.A19
PEG_TX1-: J1.332 X1.A20
PEG_TX2+: J1.336 X1.A23
PEG_TX2-: J1.338 X1.A24
PEG_TX3+: J1.342 X1.A27
PEG_TX3-: J1.344 X1.A28
PEG_TX4+: J1.350 X1.A33
PEG_TX4-: J1.352 X1.A34
PEG_TX5+: J1.356 X1.A37
PEG_TX5-: J1.358 X1.A38
PEG_TX6+: J1.362 X1.A41
PEG_TX6-: J1.364 X1.A42
PEG_TX7+: J1.368 X1.A45
PEG_TX7-: J1.370 X1.A46
PEG_TX8+: J1.376 X1.A50
PEG_TX8-: J1.378 X1.A51
PEG_TX9+: J1.382 X1.A54
PEG_TX9-: J1.384 X1.A55
PEG_TX10+: J1.390 X1.A58
PEG_TX10-: J1.392 X1.A59
PEG_TX11+: J1.396 X1.A62
PEG_TX11-: J1.398 X1.A63
PEG_TX12+: J1.402 X1.A66
PEG_TX12-: J1.404 X1.A67
PEG_TX13+: J1.408 X1.A70
PEG_TX13-: J1.410 X1.A71
PEG_TX14+: J1.416 X1.A74
PEG_TX14-: X1.A75
PEG_TX15+: J1.422 X1.A78
PEG_TX15-: J1.424 X1.A79
PWR_OK: J1.48
PWRBTN#: J1.24
RAPID_SHUTDOWN: J1.353
RSVD1: J1.95
RSVD7: J1.273
SATA0_RX+: J1.37 J2.49
SATA0_RX-: J1.39 J2.47
SATA0_TX+: J1.31 J2.41
SATA0_TX-: J1.33 J2.43
SATA1_RX+: J1.38
SATA1_RX-: J1.40
SATA1_TX+: J1.32
SATA1_TX-: J1.34
SATA2_RX+: J1.49
SATA2_RX-: J1.51
SATA2_TX+: J1.43
SATA2_TX-: J1.45
SATA3_RX+: J1.50
SATA3_RX-: J1.52
SATA3_TX+: J1.44
SATA3_TX-: J1.46
SER0_RX: J1.197
SER0_TX: J1.195
SER1_RX: J1.203
SER1_TX: J1.201
SIM_DETECT: J2.66
SLEEP#: J1.206
SMB_ALERT#: J1.30
SMB_SCL_S5: J1.26 J2.68 J4.68 X1.A5
SMB_SDA_S5: J1.28 X1.A6
SPI_CLK: J1.187
SPI_CS#: J1.194
SPI_MISO: J1.183
SPI_MOSI: J1.189
SPKR: J1.64
SUS_S3#: J1.29
SUS_S4#: J1.35
SUS_S5#: J1.47
SUS_STAT#: J1.36
SYS_RESET#: J1.98
THRM#: J1.70
THRMTRIP#: J1.69
TPM_PP: J1.191
TYPE0#: J1.327
TYPE1#: J1.333
TYPE2#: J1.334
TYPE10#: J1.193
UIM1_CLK: J2.32 J3.C3(CLK)
UIM1_DATA: J2.34 J3.C7(I/O)
UIM1_PWR: J2.36 J3.C1(VCC)
UIM1_RESET: J2.30 J3.C2(RST)
USB0+: J1.91 J2.7
USB0-: J1.89 J2.9
USB0_HOST_PRSNT: J1.96
USB1+: J1.92
USB1-: J1.90
USB2+: J1.85
USB2-: J1.83
USB3+: J1.86
USB3-: J1.84
USB4+: J1.79
USB4-: J1.77
USB5+: J1.80
USB5-: J1.78
USB6+: J1.73
USB6-: J1.71
USB7+: J1.74
USB7-: J1.72
USB_0_1_OC#: J1.88
USB_2_3_OC#: J1.87
USB_4_5_OC#: J1.76
USB_6_7_OC#: J1.75
USB_SSRX0+: J1.227 J2.37
USB_SSRX0-: J1.225 J2.35
USB_SSRX1+: J1.233
USB_SSRX1-: J1.231
USB_SSRX2+: J1.239
USB_SSRX2-: J1.237
USB_SSRX3+: J1.245
USB_SSRX3-: J1.243
USB_SSTX0: J1.226
USB_SSTX0+: J1.228 J2.5 J2.31
USB_SSTX0-: J2.29
USB_SSTX1+: J1.234
USB_SSTX1-: J1.232
USB_SSTX2+: J1.240
USB_SSTX2-: J1.238
USB_SSTX3+: J1.246
USB_SSTX3-: J1.244
VCC: J1.207 J1.208 J1.209 J1.210 J1.211 J1.212 J1.213 J1.214 J1.215 J1.216 J1.217 J1.218 J1.427 J1.428 J1.429 J1.430 J1.431 J1.432 J1.433 J1.434 J1.435 J1.436 J1.437 J1.438
VGA_BLU: J1.184
VGA_GRN: J1.182
VGA_HSYNC: J1.186
VGA_I2C_CK: J1.190
VGA_I2C_DAT: J1.192
VGA_RED: J1.178
VGA_VSYNC: J1.188
WAKE0#: J1.132 J2.54 J4.54 X1.A11
WAKE1#: J1.134
WDT: J1.54
Unconnected: J2.1 J2.10 J2.75 J3.Z1(GND1) J3.Z2(GND1) J3.Z3(GND1) J3.Z4(GND1) J3.Z5(GND1) J3.Z6(GND1) J3.Z7(GND1) J3.Z8(GND1) X1.A9 X1.A12 X1.A30 X1.A31 X1.A48 X1.A81 X1.A82 X1.B1 X1.B5 X1.B6 X1.B7 X1.B8 X1.B19 X1.B32 X1.B33 X1.B50

## Notes on the sheet
- ComExpress Connector | Storage | GPU | Camera
- Connector 1 side A | Connector 2 side A
- Check connections and mark unclear ones
- Connector 1 side B | Connector 2 side B
- figure out what to do about ? connections
- add sata
- Battery Manangment | Thunderbolt? | I/O | NIC/GSM
- hdmi
- usb 3.1
- 3.5mm jack
- Wifi is on chipset and bluetooth might be
- ethernet
- eDP 1.4 (display port)
- Add current smothing caps and esd protection
- Use m.2 GSM from sierra wireless over the usb protocol
- Take input power from thunderbolt 3 then add battery charge circuit and 9-19v input to vcc to power everything else

## Library data of the parts
J1 = 3-1827231-6:3-1827231-6: CONN RECPT 440POS 0.5MM DUAL SMT; AVAILABILITY: Unavailable; CENTERLINE_PITCH: .5; COMMENT: 3-1827231-6; DESCRIPTION: Socket Connector .5FHR04H,440,B,GIG,08/Sn,HT,NS 440 POS; EU_ROHS_COMPLIANCE: Compliant; MF: TE Connectivity; MP: 3-1827231-6; NUMBER_OF_POSITIONS: 440; PACKAGE: None; PRICE: None; PRODUCT_TYPE: Connector; TE_PURCHASE_URL: https://www.te.com/usa-en/product-3-1827231-6.html?te_bu=Cor&te_type=disp&te_campaign=seda_glo_cor-seda-global-disp-prtnr-fy19-seda-model-bom-cta_sma-317_1&elqCampaignId=32493
J2 = 2199230-3:2199230-3: CONN FEMALE 67POS 0.020 GOLD; AVAILABILITY: Unavailable; CENTERLINE_PITCH: .5 mm[.0197 in]; COMMENT: 2199230-3; DESCRIPTION: M.2 0.5PITCH 4.2H KEY B 15U'' AU; EU_ROHS_COMPLIANCE: Compliant; MF: TE Connectivity; MP: 2199230-3; NUMBER_OF_POSITIONS: 67; PACKAGE: None; PRICE: None; PRODUCT_TYPE: Socket; TE_PURCHASE_URL: https://www.te.com/usa-en/product-2199230-3.html?te_bu=Cor&te_type=disp&te_campaign=seda_glo_cor-seda-global-disp-prtnr-fy19-seda-model-bom-cta_sma-317_1&elqCampaignId=32493
J3 = Wurth_Elektronik_Electromechanic_Input-Output_Connectors_rev17b:693021010811: WR-CRD_Micro SIM_Push & Push_w Card Detection_SMT Micro SIM Push & Push Type SMT - with Card Detection - 1.25mm Height Code:Con_I-O_COM_CRD_SIM_Micro_693021010811_693021010811 <http://katalog.we-online.de/media/images/eican/Con_I-O_COM_CRD_SIM_Micro_693021010811_pf2.jpg> Details see: http://katalog.we-online.de/en/em/CRD_MICRO_SIM_PUSH_AND_PULL_CRD_DETECTION_8_PINS/693021010811 Created 2014-12-22, aslant tao 2014 (C) Würth Elektronik
J4 = 1-2199119-3:1-2199119-3: m.2 0.5pitch 3.2h Key m Goldflash; AVAILABILITY: Unavailable; DESCRIPTION: M.2 0.5PITCH 3.2H Key M Goldflash; MF: TE Connectivity / AMP; MP: 1-2199119-3; PACKAGE: None; PRICE: None
X1 = con-pc:PCI-E-164: Copy from con-pci_express(pci-e).lbr uploaded Mon Jul 2 10:15:25 2007 Library for PCI-Express x16 (PCI-E) connector. Includes connector and card edge pattern. Uploaded by JF Duval <jfduval@aqra.ca> from AQRA.ca